# Altium schematic sheet dc power.schdoc
size A4
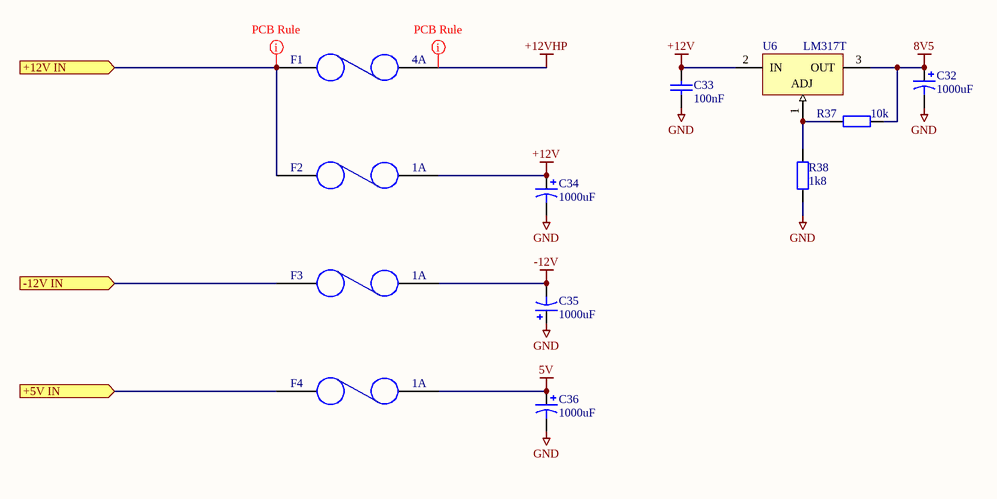
[diagram p0: dc power.schdoc]

## Parts
C32  1000uF  [CAPPR5-5x5]
C33  100nF  [CAP (3D) - 0603]
C34  1000uF  [CAPPR5-5x5]
C35  1000uF  [CAPPR5-5x5]
C36  1000uF  [CAPPR5-5x5]
F1  4A  [POLYSWITCH]
F2  1A  [3216[1206]]
F3  1A  [3216[1206]]
F4  1A  [3216[1206]]
R37  10k  [RES (3D) - 0603]
R38  1k8  [RES (3D) - 0603]
U6  LM317T  [TO220ABN]

## Ports
+5V IN (in), +12V IN (in), -12V IN (in)

## Nets
5V: C36.1 F4.2
8V5: C32.1 R37.2 U6.3(OUT)
+12V: C33.2 C34.1 F2.2 U6.2(IN)
+12VHP: F1.2
-12V: C35.2 F3.2
GND: C32.2 C33.1 C34.2 C35.1 C36.2 R38.1
+5V IN: F4.1 ; port +5V IN
+12V IN: F1.1 F2.1 ; port +12V IN
-12V IN: F3.1 ; port -12V IN
NetR37_1: R37.1 R38.2 U6.1(ADJ)

## Layout directives
rule Width Constraint [Pref Width = 50mil    Min Width = 15mil    Max Width = 250mil]: +12VHP
rule Width Constraint [Pref Width = 50mil    Min Width = 50mil    Max Width = 250mil]: +12V IN

## Library data of the parts
C32 C34-C36 = Cap Pol1: Polarized Capacitor (Radial); Manufacturer: EPCOS; Manufacturer Part No.: B41828A7107M7; Value: 1000uF; Mouser Part No.: 871-B41828A7107M7; Web Link: http://au.mouser.com/ProductDetail/EPCOS/B41828A7107M7/?qs=nVvxX1UUhUykfM7qFE3BRbEQLHdHrVYrVo8dT3SN8Ro%3d; Supplier 1: Mouser; Supplier 2: Digi-Key; Supplier Part Number 1: 667-ECA-1VM102; Supplier Part Number 2: P5169-ND
C33 = Cap: Capacitor; Manufacturer: YAEGO; Manufacturer Part No.: CC0603ZRY5V9BB104; Value: 100nF; Mouser Part no.: 603-C0603ZRY5V9BB104; Web link: http://au.mouser.com/ProductDetail/Yageo/CC0603ZRY5V9BB104/?qs=AgBp2OyFlx%252bk1xe0tOfw5lSGBXIDidlPHbEeepmuVSw%3d; Supplier 1: Mouser; Supplier 2: Digi-Key; Supplier Part Number 1: 603-C0603ZRY5V9BB104; Supplier Part Number 2: 311-1343-2-ND
F1 = FUSE ALTRONICS S5985: Manufacturer: TE CONNECTIVITY / RAYCHEM; Manufacturer Part No.: RUEF400-2; Element 14: 2078397; Mouser Part No.: 650-RUEF400-2; Web Link: http://au.mouser.com/ProductDetail/TE-Connectivity/RUEF400-2/?qs=hv6pn79dJPRrKKJp8fmA6A%3d%3d; Value: 4A; Supplier 1: Mouser; Supplier Part Number 1: 650-RUEF400-2; Supplier 2: Digi-Key; Supplier Part Number 2: RGEF400-ND
F2-F4 = FUSE ALTRONICS S5985: Manufacturer: TE CONNECTIVITY / RAYCHEM; Manufacturer Part No.: NANOSMDC110F-2; Element 14: 1861192; Mouser Part No.: 650-NANOSMDC110F-2; Web Link: http://au.mouser.com/ProductDetail/TE-Connectivity-Raychem/NANOSMDC110F-2/?qs=F6FIpiMdEVaqi0EOwT5ZJqOYTKi36iabKDMkTKOaCbU%3d; Value: 1A; Supplier 1: Mouser; Supplier Part Number 1: 650-NANOSMDC110F-2; Supplier 2: Digi-Key; Supplier Part Number 2: NANOSMDC110FDKR-ND
R37 = Res2: Resistor; Manufacturer: YAEGO; Manufacturer Part No.: AC0603JR-0710KL; Value: 10k; Mouser Part No.: 603-AC0603JR-0710KL; Web Link: http://au.mouser.com/ProductDetail/Yageo/AC0603JR-0710KL/?qs=cGU37fGUGy%2ffTpJnc0hqwyfRqkqml5N9cIWubNc1%2ffQ%3d; Supplier 1: Mouser; Supplier 2: Digi-Key; Supplier Part Number 1: 603-AC0603JR-0710KL; Supplier Part Number 2: 311-10KLECT-ND
R38 = Res2: Resistor; Manufacturer: YAEGO; Manufacturer Part No.: AC0603FR-071K8L; Value: 1k8; Mouser Part No.: 603-AC0603FR-071K8L; Web Link: http://au.mouser.com/ProductDetail/Yageo/AC0603FR-071K8L/?qs=UoPT7wUmgYI8kG5vasY4GgTvioKlpjIzfCXXRT03z8Q%3d; Supplier 1: Mouser; Supplier Part Number 1: 71-CRCW02011K80FKED; Supplier 2: Digi-Key; Supplier Part Number 2: 311-1.80KHRDKR-ND
U6 = LM317T: 1.2V to 37V Voltage Regulator; Manufacturer: ON SEMI; Manufacturer Part No.: LM317TG; Mouser Part No.: 863-LM317TG; Web Link: http://au.mouser.com/ProductDetail/ON-Semiconductor/LM317TG/?qs=2OtswVQKCOFn%2fwibROB6tiGLs9boMjQbWXUBNe5sOqI%3d; Supplier 1: Mouser; Supplier Part Number 1: 863-LM317TG; Supplier 2: Digi-Key; Supplier Part Number 2: 497-1575-5-ND